# Altium schematic sheet Mainboard.SchDoc
size A4; SheetNumber: 1; SheetTotal: 1
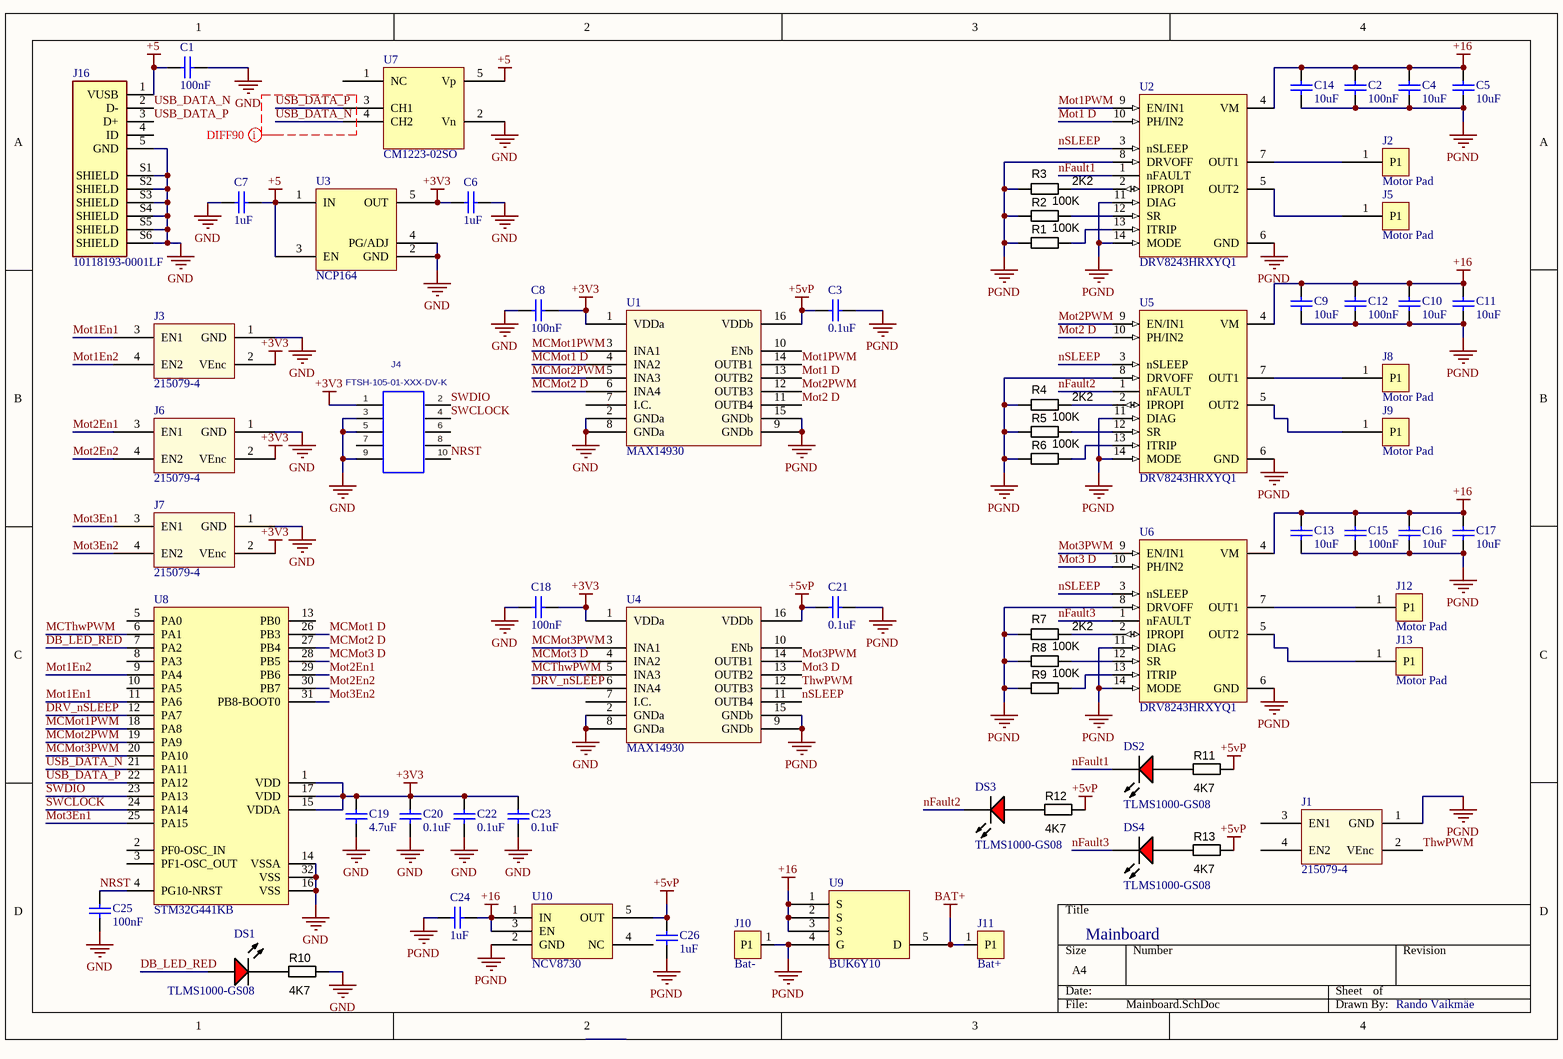
[diagram p0: Mainboard.SchDoc]

## Parts
C1  value 100nF  [1608[0603]]  (hidden comment: Cap Semi)
C2  value 100nF  [1608[0603]]  (hidden comment: Cap Semi)
C3  value 0.1uF  [1608[0603]]  (hidden comment: Cap Semi)
C4  value 10uF  [C1206]  (hidden comment: Cap Semi)
C5  value 10uF  [C1206]  (hidden comment: Cap Semi)
C6  value 1uF  [1608[0603]]  (hidden comment: Cap Semi)
C7  value 1uF  [1608[0603]]  (hidden comment: Cap Semi)
C8  value 100nF  [1608[0603]]  (hidden comment: Cap Semi)
C9  value 10uF  [C1206]  (hidden comment: Cap Semi)
C10  value 10uF  [C1206]  (hidden comment: Cap Semi)
C11  value 10uF  [C1206]  (hidden comment: Cap Semi)
C12  value 100nF  [1608[0603]]  (hidden comment: Cap Semi)
C13  value 10uF  [C1206]  (hidden comment: Cap Semi)
C14  value 10uF  [C1206]  (hidden comment: Cap Semi)
C15  value 100nF  [1608[0603]]  (hidden comment: Cap Semi)
C16  value 10uF  [C1206]  (hidden comment: Cap Semi)
C17  value 10uF  [C1206]  (hidden comment: Cap Semi)
C18  value 100nF  [1608[0603]]  (hidden comment: Cap Semi)
C19  value 4.7uF  [1608[0603]]  (hidden comment: Cap Semi)
C20  value 0.1uF  [1608[0603]]  (hidden comment: Cap Semi)
C21  value 0.1uF  [1608[0603]]  (hidden comment: Cap Semi)
C22  value 0.1uF  [1608[0603]]  (hidden comment: Cap Semi)
C23  value 0.1uF  [1608[0603]]  (hidden comment: Cap Semi)
C24  value 1uF  [1608[0603]]  (hidden comment: Cap Semi)
C25  value 100nF  [1608[0603]]  (hidden comment: Cap Semi)
C26  value 1uF  [1608[0603]]  (hidden comment: Cap Semi)
DS1  TLMS1000-GS08  [VISH-TLMS1000_V]
DS2  TLMS1000-GS08  [VISH-TLMS1000_V]
DS3  TLMS1000-GS08  [VISH-TLMS1000_V]
DS4  TLMS1000-GS08  [VISH-TLMS1000_V]
J1  215079-4  [MICRO-MATCH-FOB-04]
J2  Motor Pad  [motorPads]
J3  215079-4  [MICRO-MATCH-FOB-04]
J4  FTSH-105-01-XXX-DV-K  [FTSH-105-01-XXX-DV-K]
J5  Motor Pad  [motorPads]
J6  215079-4  [MICRO-MATCH-FOB-04]
J7  215079-4  [MICRO-MATCH-FOB-04]
J8  Motor Pad  [motorPads]
J9  Motor Pad  [motorPads]
J10  Bat-  [motorPads]
J11  Bat+  [motorPads]
J12  Motor Pad  [motorPads]
J13  Motor Pad  [motorPads]
J16  10118193-0001LF  [FCI_10118193-0001LF]
R1  value 100K  [RESC1608X55N]  (hidden comment: Thick Film)
R2  value 100K  [RESC1608X55N]  (hidden comment: Thick Film)
R3  value 2K2  [RESC1608X55N]  (hidden comment: Thick Film)
R4  value 2K2  [RESC1608X55N]  (hidden comment: Thick Film)
R5  value 100K  [RESC1608X55N]  (hidden comment: Thick Film)
R6  value 100K  [RESC1608X55N]  (hidden comment: Thick Film)
R7  value 2K2  [RESC1608X55N]  (hidden comment: Thick Film)
R8  value 100K  [RESC1608X55N]  (hidden comment: Thick Film)
R9  value 100K  [RESC1608X55N]  (hidden comment: Thick Film)
R10  value 4K7  [RESC1608X55N]  (hidden comment: Thick Film)
R11  value 4K7  [RESC1608X55N]  (hidden comment: Thick Film)
R12  value 4K7  [RESC1608X55N]  (hidden comment: Thick Film)
R13  value 4K7  [RESC1608X55N]  (hidden comment: Thick Film)
U1  MAX14930  [SOIC127P600X175-16N]
U2  DRV8243HRXYQ1  [DRV8243_VQFN-HR_14]
U3  NCP164  [SOT95P275X110-5N]
U4  MAX14930  [SOIC127P600X175-16N]
U5  DRV8243HRXYQ1  [DRV8243_VQFN-HR_14]
U6  DRV8243HRXYQ1  [DRV8243_VQFN-HR_14]
U7  CM1223-02SO  [SOT95P275X110-5N]
U8  STM32G441KB  [TQFP80P900X900X160-32N]
U9  BUK6Y10  [TO127P600X120-5N]
U10  NCV8730  [SOT95P275X110-5N]

## Nets
+3V3: C6.2 C8.1 C18.1 C19.2 C20.2 C22.2 C23.2 J3.2(VEnc) J4.1 J6.2(VEnc) J7.2(VEnc) U1.1(VDDa) U3.5(OUT) U4.1(VDDa) U8.1(VDD) U8.15(VDDA) U8.17(VDD)
+5: C1.2 C7.1 J16.1(VUSB) U3.1(IN) U3.3(EN) U7.5(Vp)
+5vP: C3.2 C21.2 C26.2 R11.2 R12.2 R13.2 U1.16(VDDb) U4.16(VDDb) U10.5(OUT)
+16: C2.2 C4.2 C5.2 C9.2 C10.2 C11.2 C12.2 C13.2 C14.2 C15.2 C16.2 C17.2 C24.1 U2.4(VM) U5.4(VM) U6.4(VM) U9.1(S) U9.2(S) U9.3(S) U10.1(IN) U10.3(EN)
BAT+: J11.1(P1) U9.5(D)
GND: C1.1 C6.1 C7.2 C8.2 C18.2 C19.1 C20.1 C22.1 C23.1 C25.2 J3.1(GND) J4.3 J4.5 J4.9 J6.1(GND) J7.1(GND) J16.5(GND) J16.S1(SHIELD) J16.S2(SHIELD) J16.S3(SHIELD) J16.S4(SHIELD) J16.S5(SHIELD) J16.S6(SHIELD) R10.2 U1.2(GNDa) U1.8(GNDa) U3.2(GND) U3.4(PG/ADJ) U4.2(GNDa) U4.8(GNDa) U7.2(Vn) U8.14(VSSA) U8.16(VSS) U8.32(VSS)
PGND: C2.1 C3.1 C4.1 C5.1 C9.1 C10.1 C11.1 C12.1 C13.1 C14.1 C15.1 C16.1 C17.1 C21.1 C24.2 C26.1 J1.1(GND) J10.1(P1) R1.1 R2.1 R3.2 R4.2 R5.1 R6.1 R7.2 R8.1 R9.1 U1.9(GNDb) U1.15(GNDb) U2.6(GND) U2.8(DRVOFF) U2.11(DIAG) U2.14(MODE) U4.9(GNDb) U4.15(GNDb) U5.6(GND) U5.8(DRVOFF) U5.11(DIAG) U5.14(MODE) U6.6(GND) U6.8(DRVOFF) U6.11(DIAG) U6.14(MODE) U9.4(G) U10.2(GND)
DB_LED_RED: DS1.1(A) U8.7(PA2)
DRV_nSLEEP: U4.6(INA4) U8.12(PA7)
MCMot1 D: U1.4(INA2) U8.26(PB3)
MCMot1PWM: U1.3(INA1) U8.18(PA8)
MCMot2 D: U1.6(INA4) U8.27(PB4)
MCMot2PWM: U1.5(INA3) U8.19(PA9)
MCMot3 D: U4.4(INA2) U8.28(PB5)
MCMot3PWM: U4.3(INA1) U8.20(PA10)
MCThwPWM: U4.5(INA3) U8.6(PA1)
Mot1 D: U1.13(OUTB2) U2.10(PH/IN2)
Mot1En1: J3.3(EN1) U8.11(PA6)
Mot1En2: J3.4(EN2) U8.9(PA4)
Mot1PWM: U1.14(OUTB1) U2.9(EN/IN1)
Mot2 D: U1.11(OUTB4) U5.10(PH/IN2)
Mot2En1: J6.3(EN1) U8.29(PB6)
Mot2En2: J6.4(EN2) U8.30(PB7)
Mot2PWM: U1.12(OUTB3) U5.9(EN/IN1)
Mot3 D: U4.13(OUTB2) U6.10(PH/IN2)
Mot3En1: J7.3(EN1) U8.25(PA15)
Mot3En2: J7.4(EN2) U8.31(PB8-BOOT0)
Mot3PWM: U4.14(OUTB1) U6.9(EN/IN1)
nFault1: DS2.2(K) U2.1(nFAULT)
nFault2: DS3.2(K) U5.1(nFAULT)
nFault3: DS4.2(K) U6.1(nFAULT)
NRST: C25.1 J4.10 U8.4(PG10-NRST)
nSLEEP: U2.3(nSLEEP) U4.11(OUTB4) U5.3(nSLEEP) U6.3(nSLEEP)
SWCLOCK: J4.4 U8.24(PA14)
SWDIO: J4.2 U8.23(PA13)
ThwPWM: J1.2(VEnc) U4.12(OUTB3)
USB_DATA_N: J16.2(D-) U7.4(CH2) U8.21(PA11)
USB_DATA_P: J16.3(D+) U7.3(CH1) U8.22(PA12)
NetDS1_2: DS1.2(K) R10.1
NetDS2_1: DS2.1(A) R11.1
NetDS3_1: DS3.1(A) R12.1
NetDS4_1: DS4.1(A) R13.1
NetJ2_1: J2.1(P1) U2.7(OUT1)
NetJ5_1: J5.1(P1) U2.5(OUT2)
NetJ8_1: J8.1(P1) U5.7(OUT1)
NetJ9_1: J9.1(P1) U5.5(OUT2)
NetJ12_1: J12.1(P1) U6.7(OUT1)
NetJ13_1: J13.1(P1) U6.5(OUT2)
NetR1_2: R1.2 U2.13(ITRIP)
NetR2_2: R2.2 U2.12(SR)
NetR3_1: R3.1 U2.2(IPROPI)
NetR4_1: R4.1 U5.2(IPROPI)
NetR5_2: R5.2 U5.12(SR)
NetR6_2: R6.2 U5.13(ITRIP)
NetR7_1: R7.1 U6.2(IPROPI)
NetR8_2: R8.2 U6.12(SR)
NetR9_2: R9.2 U6.13(ITRIP)

Not connected (* = marked no-connect by the designer): J1 3(EN1) 4(EN2); J4 6 7 8; J16 4(ID); U1 7(I.C.) 10(ENb); U4 7(I.C.) 10(ENb); U7 1(NC); U8 2(PF0-OSC_IN) 3(PF1-OSC_OUT) 5(PA0) 8(PA3) 10(PA5) 13(PB0); U10 4(NC)

## Layout directives
differential pair; differential pair class DIFF90: USB_DATA_N, USB_DATA_P

## Notes on the sheet
- Mainboard
- Rando Vaikmäe

## Library data of the parts
C1-C26 = Cap Semi: Capacitor (Semiconductor SIM Model); Published: 8-Jun-2000; LatestRevisionDate: 29-May-2009; LatestRevisionNote: IPC-7351 Footprint Added.; PackageReference: C1206; Publisher: Altium Limited; PackageDescription: Chip Capacitor
DS1-DS4 = CMP-2000-07254-1: Low Current LED, 40 mW, 1.8 V, -40 to 100 degC, 2-Pin SMD (0603), RoHS, Tape and Reel; Manufacturer: Vishay; Lens Shape: Rectangular; Automotive Qualification Standard: AEC-Q100; Wavelength Typ: 636nm; SVHC: ToBeAdvised; LED Colour: Red; Bulb Size: 1.6mmx0.8mm; Forward Voltage: 1.8V; Luminous Intensity: 4mcd; Forward Current If: 2mA; Viewing Angle: 80°; Datasheet Version: Rev. 1.7, 02/2011; Datasheet URL: https://datasheet.ciiva.com/5798/1698881-5798337.pdf; LED Mounting: SMD; Packaging: CutTape; Package Reference: TLMS1000; Manufacturer URL: http://www.vishay.com/; Mounting Technology: SurfaceMount; Product Range: -; Package Description: 2-Pin Surface Mount Device, Body 1.6 x 0.8 mm; MSL: MSL2-1year
J1 J3 J6 J7 = 215079-4: Micro-MaTch 215079-4
J4 = FTSH-105-01-XXX-DV-K: TERMINAL STRIP, .050"(1.27mm) PITCH, 10 PINS, KEYED; MANUFACTURER: SAMTEC; CREATED: November 30, 2016 - Wendy Xin; PCB DECAL: FTSH-105-01-XXX-DV-K
J10 J11 = Bat: Batteryterminal
J16 = 10118193-0001LF: USB - micro B USB 2.0 Receptacle Connector 5 Position Surface Mount, Right Angle; Through Hole; MF: Amphenol ICC; Availability: Unavailable; SnapEDA_Link: https://www.snapeda.com/parts/10118193-0001LF/Amphenol%20FCI/view-part/2758989/?ref=snap; MP: 10118193-0001LF; Price: None; Value: *; Package: None
R1 R2 R5 R6 R8 R9 = RES_100K_0603_1%: Resistor SMD chip 100k Ohm 0.1W 1% 0603; Manufacturer 1: Vishay/Dale; Manufacturer Part Number 1: CRCW0603100KFKEA; Ratings: 1/10W; SCDType: spec; Package / Case: 0603 (2012 metric); Supplier 1: Digi-Key; Supplier Part Number 1: 541-100KHCT-ND; Tolerance: ±1%
R3 R4 R7 = RES_2K2_0603_5%: Resistor SMD chip 2.2k Ohm 0.1W 5% 0603; Manufacturer 1: Yageo; Manufacturer Part Number 1: RC0603JR-072K2L; Ratings: 1/10 W; SCDType: spec; Temperature Coefficient: ±100ppm/°C; Package / Case: 0603 (1608 metric); Tolerance: ±5%; Material: Thick Film; Supplier 1: Digi-Key; Supplier Part Number 1: 311-2.2KGRDKR-ND; RoHS 1: RoHS Compliant; ComponentLink1URL: http://www.yageo.com/documents/recent/PYu-RC0603_51_RoHS_L_4.pdf; ComponentLink1Description: http://www.yageo.com/documents/recent/PYu-RC0603_51_RoHS_L_4.pdf; Supplier 2: Digi-Key; Supplier Part Number 2: 1276-5070-6-ND; Manufacturer 2: Samsung Electro-Mechanics America, Inc; Manufacturer Part Number 2: RC1608J222CS; RoHS 2: RoHS Compliant; ComponentLink2URL: http://www.samsungsem.com/servlet/FileDownload?filename=productcatalog/pdf/Chip_Resistor.pdf; ComponentLink2Description: http://www.samsungsem.com/servlet/FileDownload?filename=productcatalog/pdf/Chip_Resistor.pdf; Supplier 3: Digi-Key; Supplier Part Number 3: RMCF0603JT2K20DKR-ND; Manufacturer 3: Stackpole Electronics Inc; Manufacturer Part Number 3: RMCF0603JT2K20; RoHS 3: RoHS Compliant; ComponentLink3URL: http://www.seielect.com/Catalog/SEI-RMCF_RMCP.pdf; ComponentLink3Description: http://www.seielect.com/Catalog/SEI-RMCF_RMCP.pdf; Supplier 4: Digi-Key; Supplier Part Number 4: RHM2.2KCGDKR-ND; Manufacturer 4: Rohm Semiconductor; Manufacturer Part Number 4: MCR03ERTJ222; RoHS 4: RoHS Compliant; ComponentLink4URL: http://rohmfs.rohm.com/en/products/databook/datasheet/passive/resistor/chip_resistor/mcr_g.pdf; ComponentLink4Description: http://rohmfs.rohm.com/en/products/databook/datasheet/passive/resistor/chip_resistor/mcr_g.pdf; Supplier 5: Digi-Key; Supplier Part Number 5: P2.2KGDKR-ND; Manufacturer 5: Panasonic Electronic Components; Manufacturer Part Number 5: ERJ-3GEYJ222V; RoHS 5: RoHS Compliant; ComponentLink5URL: http://industrial.panasonic.com/www-cgi/jvcr13pz.cgi?E+PZ+3+AOA0001+ERJ3GEYJ222V+7+WW; ComponentLink5Description: http://industrial.panasonic.com/www-cgi/jvcr13pz.cgi?E+PZ+3+AOA0001+ERJ3GEYJ222V+7+WW
R10-R13 = RES_4K7_0603_1%: Resistor SMD chip 4.7K Ohm 0.1W 1% 0603; Manufacturer: Yageo; Manufacturer Part Number: RC0603FR-074K7L; Ratings: 1/10W; SCDType: undef; Package / Case: 0603 (1608 Metric); Supplier 1: Digi-Key; Supplier Part Number 1: 311-4.70KHRCT-ND; Tolerance: ±1%
U1 U4 = MAX14930: MAX14930DASE+
U2 U5 U6 = DRV8243H-Q1_VQFN-HR_14: Automotive H-Bridge Driver with Integrated Current Sense and Diagnostics
U3 = NCP164: NCP164CSN330T1G
U7 = CM1223-02SO: CM1223-02SO TVS diode array
U9 = BUK6Y10: BUK6Y10-30PX
U10 = NCV8730: NCV8730ASN500T1G